# EAGLE design PIC18LF67K40-breakout (EAGLE 9.4.1)
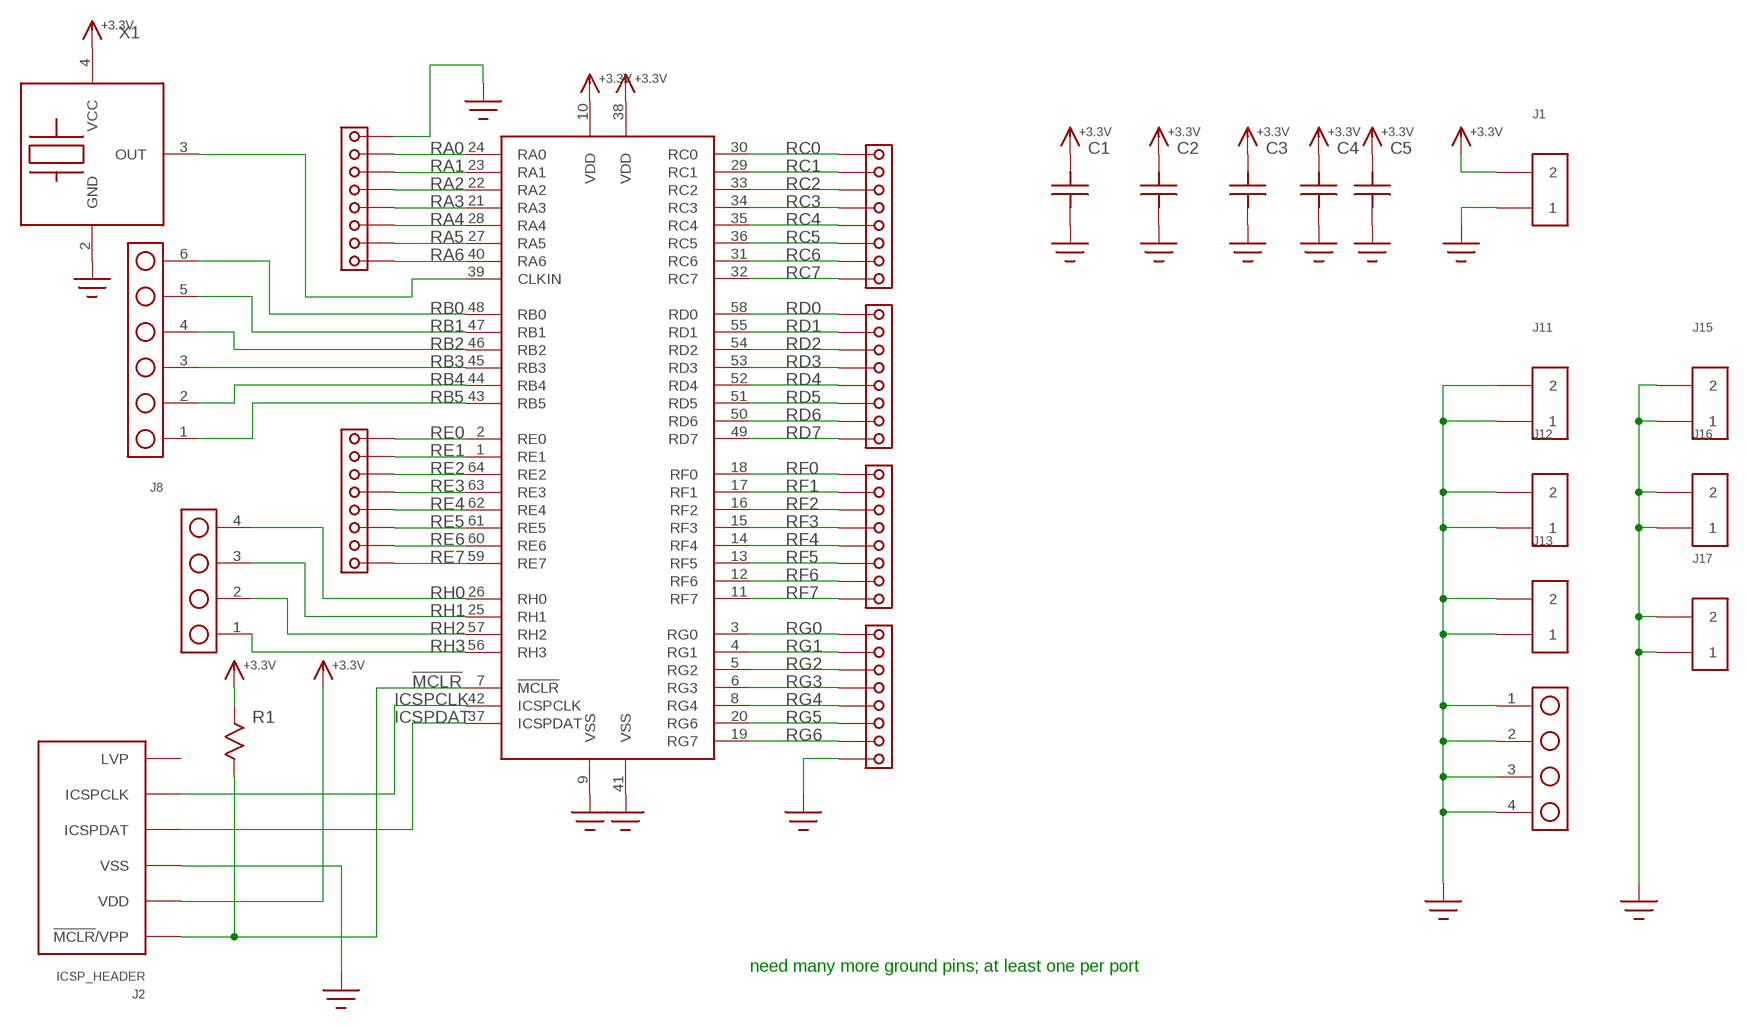
[diagram p0: schematic, sheet 1]

## Parts
C1  C1206  [1206]
C2  C1206  [1206]
C3  C0603  [C0603]
C4  C0603  [C0603]
C5  C0603  [C0603]
IC1  PIC18LF67K40  [TQFP-100-10X10]
J1  HEADER_2PIN  [HEADER_2PIN]
J2  ICSP_HEADER  [HEADER_6PIN]
J3  HEADER_8PIN_TIGHT  [HEADER_8_PIN]
J4  HEADER_8PIN_TIGHT  [HEADER_8_PIN]
J5  HEADER_8PIN_TIGHT  [HEADER_8_PIN]
J6  HEADER_8PIN_TIGHT  [HEADER_8_PIN]
J7  HEADER_8PIN_TIGHT  [HEADER_8_PIN]
J8  HEADER_6PIN  [HEADER_6PIN]
J9  HEADER_4PIN  [HEADER_4PIN]
J10  HEADER_8PIN_TIGHT  [HEADER_8_PIN]
J11  HEADER_2PIN  [HEADER_2PIN]
J12  HEADER_2PIN  [HEADER_2PIN]
J13  HEADER_2PIN  [HEADER_2PIN]
J14  HEADER_4PIN  [HEADER_4PIN]
J15  HEADER_2PIN  [HEADER_2PIN]
J16  HEADER_2PIN  [HEADER_2PIN]
J17  HEADER_2PIN  [HEADER_2PIN]
R1  R0603  [R0603]
X1  XTAL_OSC  [XTAL_3.2X5]

## Nets
!MCLR!: IC1.7(!MCLR!) J2.1(!MCLR!/VPP) R1.P$2
+3.3V: C1.P$2 C2.P$2 C3.P$2 C4.P$2 C5.P$2 IC1.10(VDD) IC1.38(VDD) J1.2 J2.2(VDD) R1.P$1 X1.4(VCC)
GND: C1.P$1 C2.P$1 C3.P$1 C4.P$1 C5.P$1 IC1.9(VSS) IC1.41(VSS) J1.1 J2.3(VSS) J6.8 J10.8 J11.1 J11.2 J12.1 J12.2 J13.1 J13.2 J14.1 J14.2 J14.3 J14.4 J15.1 J15.2 J16.1 J16.2 J17.1 J17.2 X1.2(GND)
ICSPCLK: IC1.42(ICSPCLK) J2.5(ICSPCLK)
ICSPDAT: IC1.37(ICSPDAT) J2.4(ICSPDAT)
N$11: IC1.39(CLKIN) X1.3(OUT)
RA0: IC1.24(RA0) J6.7
RA1: IC1.23(RA1) J6.6
RA2: IC1.22(RA2) J6.5
RA3: IC1.21(RA3) J6.4
RA4: IC1.28(RA4) J6.3
RA5: IC1.27(RA5) J6.2
RA6: IC1.40(RA6) J6.1
RB0: IC1.48(RB0) J8.6
RB1: IC1.47(RB1) J8.5
RB2: IC1.46(RB2) J8.4
RB3: IC1.45(RB3) J8.3
RB4: IC1.44(RB4) J8.2
RB5: IC1.43(RB5) J8.1
RC0: IC1.30(RC0) J3.1
RC1: IC1.29(RC1) J3.2
RC2: IC1.33(RC2) J3.3
RC3: IC1.34(RC3) J3.4
RC4: IC1.35(RC4) J3.5
RC5: IC1.36(RC5) J3.6
RC6: IC1.31(RC6) J3.7
RC7: IC1.32(RC7) J3.8
RD0: IC1.58(RD0) J4.1
RD1: IC1.55(RD1) J4.2
RD2: IC1.54(RD2) J4.3
RD3: IC1.53(RD3) J4.4
RD4: IC1.52(RD4) J4.5
RD5: IC1.51(RD5) J4.6
RD6: IC1.50(RD6) J4.7
RD7: IC1.49(RD7) J4.8
RE0: IC1.2(RE0) J7.8
RE1: IC1.1(RE1) J7.7
RE2: IC1.64(RE2) J7.6
RE3: IC1.63(RE3) J7.5
RE4: IC1.62(RE4) J7.4
RE5: IC1.61(RE5) J7.3
RE6: IC1.60(RE6) J7.2
RE7: IC1.59(RE7) J7.1
RF0: IC1.18(RF0) J5.1
RF1: IC1.17(RF1) J5.2
RF2: IC1.16(RF2) J5.3
RF3: IC1.15(RF3) J5.4
RF4: IC1.14(RF4) J5.5
RF5: IC1.13(RF5) J5.6
RF6: IC1.12(RF6) J5.7
RF7: IC1.11(RF7) J5.8
RG0: IC1.3(RG0) J10.1
RG1: IC1.4(RG1) J10.2
RG2: IC1.5(RG2) J10.3
RG3: IC1.6(RG3) J10.4
RG4: IC1.8(RG4) J10.5
RG5: IC1.20(RG6) J10.6
RG6: IC1.19(RG7) J10.7
RH0: IC1.26(RH0) J9.4
RH1: IC1.25(RH1) J9.3
RH2: IC1.57(RH2) J9.2
RH3: IC1.56(RH3) J9.1
Unconnected: J2.6(LVP)

## Notes on the sheet
- need many more ground pins; at least one per port

## Library data of the parts
C1-C5 = yapo:C
IC1 = yapo:PIC18LF67K40
J1 J11-J13 J15-J17 = yapo:HEADER_2PIN
J2 = yapo:ICSP_HEADER
J3-J7 J10 = yapo:HEADER_8PIN_TIGHT
J8 = yapo:HEADER_6PIN
J9 J14 = yapo:HEADER_4PIN
R1 = yapo:R
X1 = yapo:XTAL_OSC

## Board
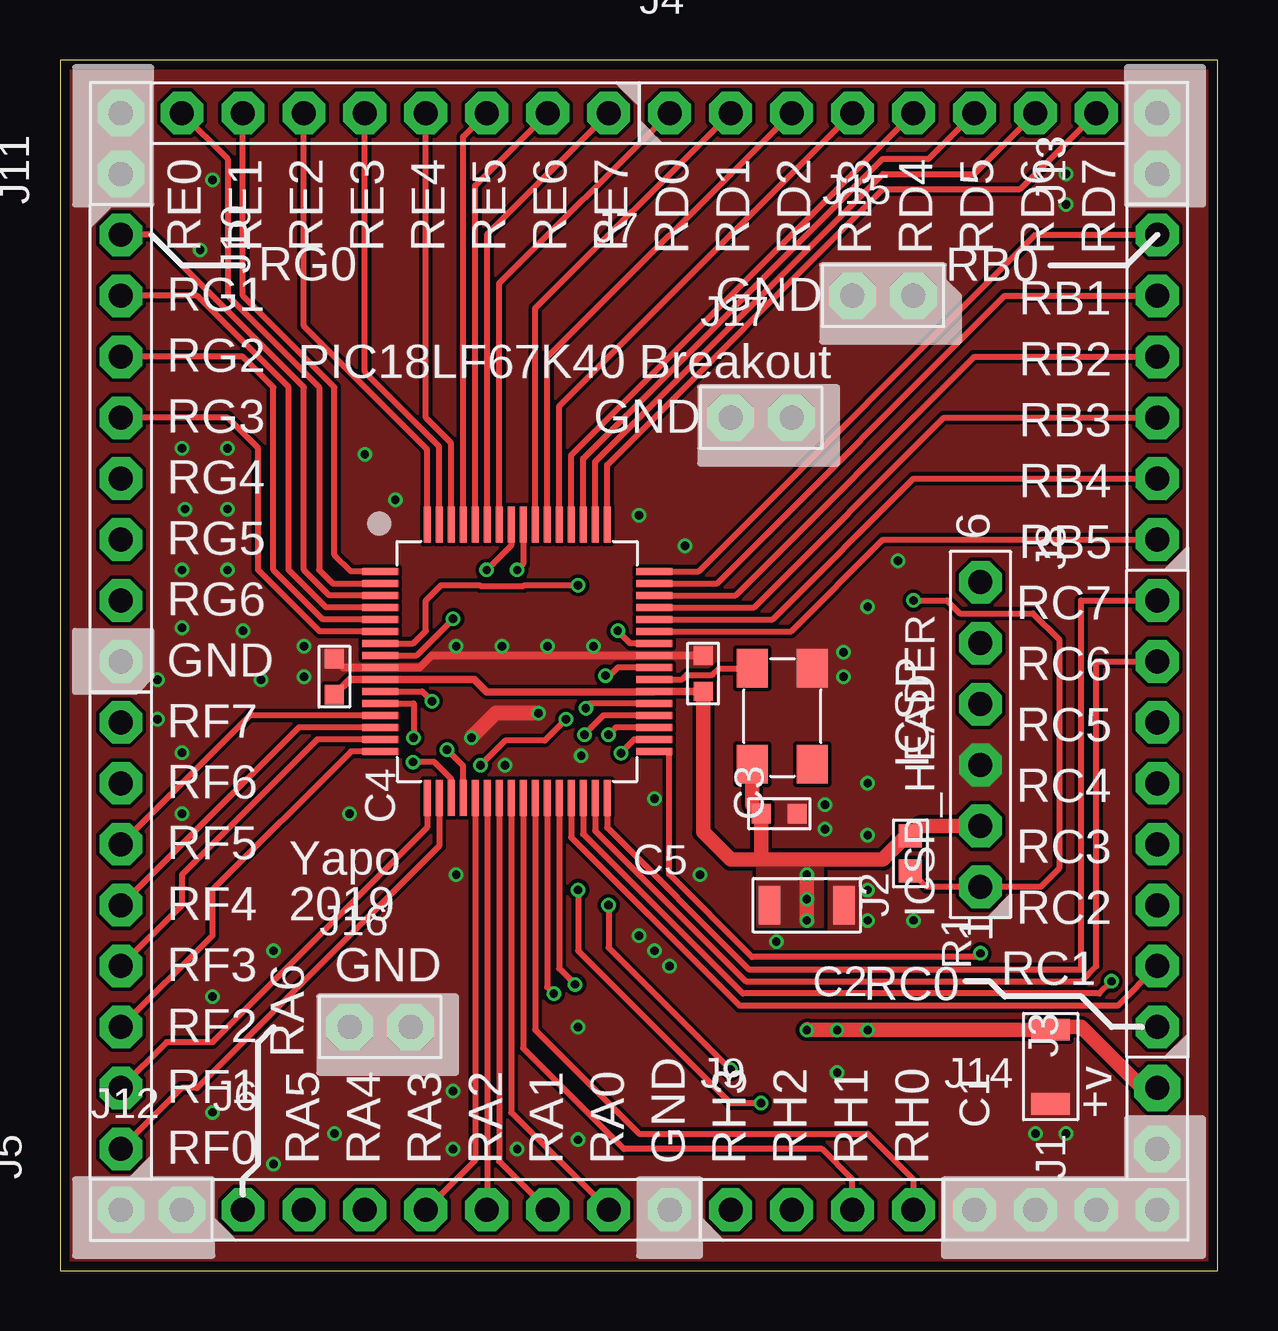
[diagram p1: board, top side]
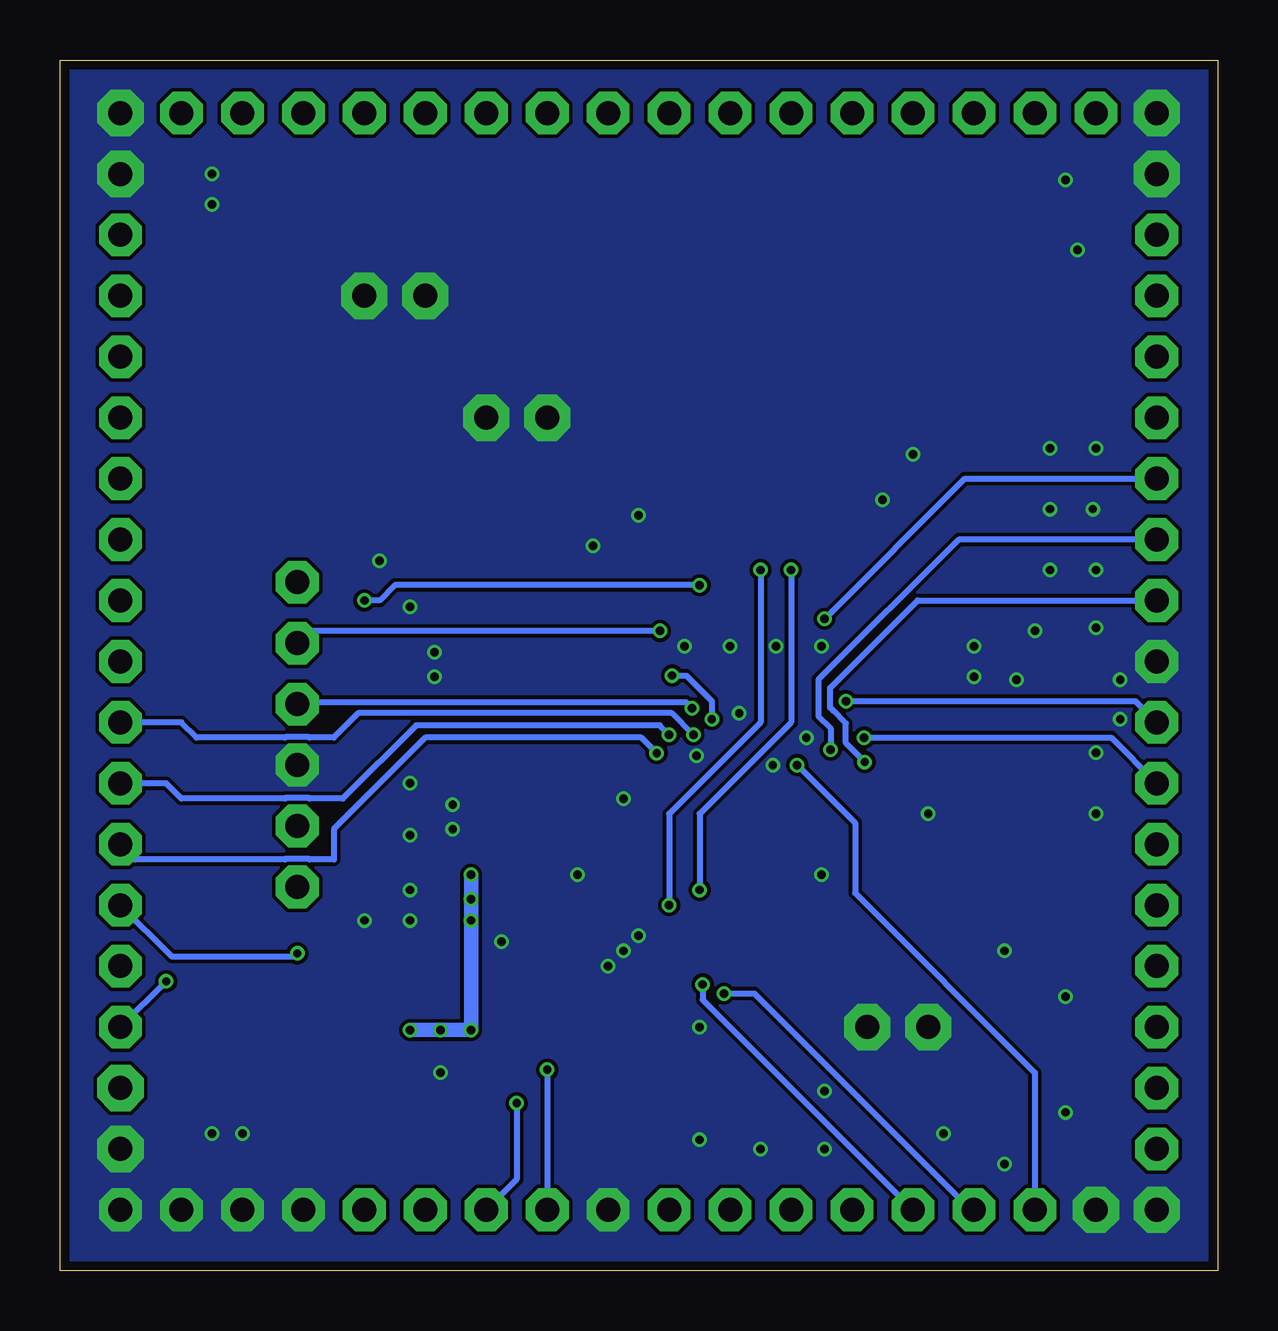
[diagram p2: board, bottom side, seen from below]

Size 48.24 x 50.47 mm. Coordinates in mm from the lower left corner, seen from the top.
Outline: 0,0 48.24,0 48.24,50.47 0,50.47 0,0
Copper layers (1*16): Top 0.035559375mm / dielectric 1.6mm / Bottom 0.035559375mm
Design rules "oshpark-2layer *": minimum track width 6mil, minimum drill 10mil, track to track 6mil, track to pad 6mil, pad to pad 6mil, via to via 6mil, smd to smd 6mil, copper to edge 15mil, drill to drill 6mil, minimum pad ring 5mil, minimum via ring 5mil, stop-mask expansion 2.5mil, vias tented up to drill 20mil, thermal gap 10mil

### Footprints (pad centres in the part's own frame; a part is rotated, then mirrored left to right if it is on the bottom)
1206 = smd 0.9 x 1.6: P$1 -1.55,0; P$2 1.55,0
C0603 = smd 0.8 x 0.8: P$1 -0.75,0; P$2 0.75,0
TQFP-100-10X10 = smd 1.5 x 0.3: 1 -5.7,3.75; 2 -5.7,3.25; 3 -5.7,2.75; 4 -5.7,2.25; 5 -5.7,1.75; 6 -5.7,1.25; 7 -5.7,0.75; 8 -5.7,0.25; 9 -5.7,-0.25; 10 -5.7,-0.75; 11 -5.7,-1.25; 12 -5.7,-1.75; 13 -5.7,-2.25; 14 -5.7,-2.75; 15 -5.7,-3.25; 16 -5.7,-3.75; 33 5.7,-3.75; 34 5.7,-3.25; 35 5.7,-2.75; 36 5.7,-2.25; 37 5.7,-1.75; 38 5.7,-1.25; 39 5.7,-0.75; 40 5.7,-0.25; 41 5.7,0.25; 42 5.7,0.75; 43 5.7,1.25; 44 5.7,1.75; 45 5.7,2.25; 46 5.7,2.75; 47 5.7,3.25; 48 5.7,3.75 | smd 0.3 x 1.5: 17 -3.75,-5.7; 18 -3.25,-5.7; 19 -2.75,-5.7; 20 -2.25,-5.7; 21 -1.75,-5.7; 22 -1.25,-5.7; 23 -0.75,-5.7; 24 -0.25,-5.7; 25 0.25,-5.7; 26 0.75,-5.7; 27 1.25,-5.7; 28 1.75,-5.7; 29 2.25,-5.7; 30 2.75,-5.7; 31 3.25,-5.7; 32 3.75,-5.7; 49 3.75,5.7; 50 3.25,5.7; 51 2.75,5.7; 52 2.25,5.7; 53 1.75,5.7; 54 1.25,5.7; 55 0.75,5.7; 56 0.25,5.7; 57 -0.25,5.7; 58 -0.75,5.7; 59 -1.25,5.7; 60 -1.75,5.7; 61 -2.25,5.7; 62 -2.75,5.7; 63 -3.25,5.7; 64 -3.75,5.7
HEADER_2PIN = drill 1 pad 1.93 octagon: 1 -1.27,0; 2 1.27,0
HEADER_6PIN = drill 1 pad 1.778 octagon: 1 -6.35,0; 2 -3.81,0; 3 -1.27,0; 4 1.27,0; 5 3.81,0; 6 6.35,0
HEADER_8_PIN = drill 1 pad 1.778 octagon: 1 -8.89,0; 2 -6.35,0; 3 -3.81,0; 4 -1.27,0; 5 1.27,0; 6 3.81,0; 7 6.35,0; 8 8.89,0
HEADER_4PIN = drill 1 pad 1.778 octagon: 1 -3.81,0; 2 -1.27,0; 3 1.27,0; 4 3.81,0
R0603 = smd 0.95 x 0.95: P$1 -0.725,0; P$2 0.725,0
XTAL_3.2X5 = smd 1.6 x 1.3: 1 -2,-1.25; 2 2,-1.25; 3 2,1.25; 4 -2,1.25

### Placement (x,y rotation side)
C1  41.27,8.51 90 top
C2  31.11,15.24 180 top
C3  26.8,24.89 270 top
C4  11.43,24.77 270 top
C5  29.97,19.05 180 top
IC1  19.05,25.4 0 top
J1  45.72,6.35 90 top
J2  38.35,22.35 90 top
J3  45.72,19.05 90 top
J4  34.29,48.26 0 top
J5  2.54,13.97 90 top
J6  16.51,2.54 0 top
J7  13.97,48.26 180 top
J8  45.72,36.83 90 top
J9  31.75,2.54 0 top
J10  2.54,34.29 270 top
J11  2.54,46.99 90 top
J12  3.81,2.54 0 top
J13  45.72,46.99 90 top
J14  41.91,2.54 0 top
J15  34.29,40.64 0 top
J16  13.34,10.16 0 top
J17  29.21,35.56 0 top
R1  35.43,17.4 270 top
X1  30.1,23.11 90 top

### Tracks (layer width: path | path; a pad name or v marks a point on that pad's centre or on a via)
!MCLR!  (via drill 0.35)
  Top 0.254: R1.P$2 36.1,16 J2.1 40.87,16 41.63,16.76 41.63,26.31 40.54,27.41 37.49,27.41 36.96,27.94 v35.56,27.94 | IC1.7 14.72,26.15 15.24,26.67 15.24,27.94 15.88,28.57 17.48,28.57 17.51,28.55 19.32,28.55 19.34,28.57 v21.59,28.57
  Bottom 0.254: v21.59,28.57 34.29,28.57 34.92,27.94 v35.56,27.94
+3.3V  (via drill 0.35)
  Top 0.254: IC1.38 24.77,24.15 24.75,24.13 | C3.P$2 | v32.38,10.03 32.36,10.06 31.14,10.06
  Top 0.305: C4.P$2 12.06,24.65 IC1.10 17.26,24.65 17.78,24.13 24.75,24.13 | 24.77,24.15 C3.P$2
  Top 0.61: J1.2 45.09,7.62 42.55,10.16 41.38,10.16 C1.P$2 41.25,10.03 v31.11,10.03 31.14,10.06 | J2.2 35.85,18.54 R1.P$1 35.27,18.12 34.29,17.14 29.21,17.14 | 29.21,17.14 29.21,19.04 C5.P$2 28.85,19.42 X1.4 | C3.P$2 26.8,18.29 27.94,17.14 29.21,17.14 | v31.11,14.61 v31.11,16.51
  Bottom 0.61: v33.66,10.03 v31.11,10.03 v31.11,16.51
  other vias: 31.11,15.49
  pour Top (no thermals): 31.75,14.35 29.08,14.35 29.08,17.14 31.75,17.14
GND  (via drill 0.35)
  Top 0.254: C3.P$1
  Top 0.305: C4.P$1 11.79,25.15 IC1.9 14.99,25.15 15.49,25.65 IC1.41 C3.P$1
  Top 0.61: v17.14,22.23 18.16,23.24 v19.94,23.24
  other vias: 24.77,19.68 6.35,45.47 10.16,24.77 10.16,26.04 32.64,24.77 32.64,25.78 31.88,19.43 22.23,26.04 31.88,18.41 6.99,29.21 6.99,31.75 6.99,34.29 5.08,21.59 4.06,22.99 12.06,19.05 16.51,16.51 6.35,11.43 16.38,7.49 16.38,5.08 19.05,5.08 21.59,5.46 21.59,10.16 24.77,13.34 33.66,15.88 33.66,14.61 40.64,5.71 41.91,5.71 26.67,16.51 35.56,14.61 32.38,8.26 33.66,20.32 33.66,27.69 34.92,29.59 26.04,30.23 24.13,31.5 13.97,32.13 12.7,34.04 41.91,45.72 41.91,44.45 5.84,42.55 5.08,34.29 5.21,31.75 5.08,29.21 5.08,26.8 7.62,26.67 4.06,24.64 8.38,24.64 5.08,19.05 8.89,13.34 8.89,4.45 6.35,6.6 11.43,5.71 16.51,26.04 18.41,26.04 20.32,26.04 29.84,13.72 18.54,21.08 21.72,21.46 33.66,18.16 24.13,13.97 25.4,12.7
  pour Top (rank 2, no thermals): 0,0 48.26,0 48.26,50.16 0,50.16
  pour Bottom (no thermals): 0,0 48.26,0 48.26,50.16 0,50.16
ICSPCLK  (via drill 0.35)
  Top 0.254: IC1.42 23.76,26.15 v23.24,26.67
  Bottom 0.254: v23.24,26.67 37.85,26.67 J2.5
ICSPDAT  (via drill 0.35)
  Top 0.254: IC1.37 22.11,23.65 v21.91,23.45
  Bottom 0.254: v21.91,23.45 22.16,23.7 38.27,23.7 J2.4
N$11
  Top 0.254: IC1.39 25.92,24.65 26.11,24.84 27.19,24.84 27.46,25.11 X1.3
RA0
  Top 0.254: IC1.24 18.8,6.6 J6.7
RA1
  Top 0.254: IC1.23 18.3,4.56 J6.6
RA2
  Top 0.254: IC1.22 17.8,2.56 J6.5
RA3
  Top 0.254: IC1.21 17.3,4.6 J6.4
RA4  (via drill 0.35)
  Top 0.254: IC1.28 20.8,12.6 v21.46,11.94
  Bottom 0.254: v21.46,11.94 21.46,11.3 J6.3
RA5  (via drill 0.35)
  Top 0.254: IC1.27 20.3,11.83 v20.57,11.56
  Bottom 0.254: v20.57,11.56 19.3,11.56 10.29,2.54 J6.2
RA6  (via drill 0.35)
  Top 0.254: IC1.40 23.25,25.15 22.86,24.77 22.78,24.77 v22.73,24.81 | v21.08,22.99 20.19,22.1 18.54,22.1 v17.53,21.08
  Bottom 0.254: v22.73,24.81 22.15,24.81 21.08,23.75 v21.08,22.99 | v17.53,21.08 15.11,18.67 15.11,15.75 7.62,8.26 J6.1
RB0
  Top 0.254: IC1.48 26.61,29.15 40.64,43.18 J8.6
RB1
  Top 0.254: IC1.47 27.38,28.65 39.37,40.64 J8.5
RB2
  Top 0.254: IC1.46 28.15,28.15 38.1,38.1 J8.4
RB3
  Top 0.254: IC1.45 28.92,27.65 36.83,35.56 J8.3
RB4
  Top 0.254: IC1.44 29.69,27.15 35.56,33.02 J8.2
RB5
  Top 0.254: IC1.43 30.46,26.65 34.29,30.48 J8.1
RC0  (via drill 0.35)
  Top 0.254: IC1.30 21.8,18.2 28.45,11.56 43.31,11.56 v43.81,12.06
  Bottom 0.254: v43.81,12.06 J3.1
RC1
  Top 0.254: IC1.29 21.3,18.07 28.32,11.05 44.07,11.05 J3.2
RC2  (via drill 0.35)
  Top 0.254: IC1.33 25.34,21.65 25.38,21.61 25.38,16.53 28.83,13.08 38.35,13.08 v38.35,13.23
  Bottom 0.254: v38.35,13.23 38.48,13.1 43.58,13.1 J3.3
RC3  (via drill 0.35)
  Top 0.254: IC1.34 23.93,22.15 23.38,21.6 v23.38,21.58
  Bottom 0.254: v23.38,21.58 24.02,22.23 33.02,22.23 36.83,18.41 36.83,17.14 37.84,17.14 37.87,17.17 38.84,17.17 38.86,17.14 45.09,17.14 J3.4
RC4  (via drill 0.35)
  Top 0.254: IC1.35 23.16,22.65 v22.86,22.35
  Bottom 0.254: v22.86,22.35 23.24,22.73 33.4,22.73 36.45,19.68 37.84,19.68 37.87,19.71 38.84,19.71 38.86,19.68 43.18,19.68 43.81,20.32 J3.5
RC5  (via drill 0.35)
  Top 0.254: IC1.36 22.64,23.15 21.85,22.36 v21.85,22.34
  Bottom 0.254: v21.85,22.34 22.75,23.24 35.81,23.24 36.83,22.23 37.84,22.23 37.87,22.25 38.84,22.25 38.86,22.23 42.55,22.23 43.18,22.86 J3.6
RC6
  Top 0.254: IC1.31 22.3,18.34 28.57,12.06 42.55,12.06 43.18,12.7 43.18,25.4 J3.7
RC7
  Top 0.254: IC1.32 22.8,18.48 28.7,12.57 42.55,12.57 42.55,27.94 J3.8
RD0
  Top 0.254: IC1.58 18.3,41.16 J4.1
RD1
  Top 0.254: IC1.55 19.8,40.12 J4.2
RD2
  Top 0.254: IC1.54 20.3,38.08 J4.3
RD3
  Top 0.254: IC1.53 20.8,36.04 J4.4
RD4
  Top 0.254: IC1.52 21.3,34 J4.5
RD5
  Top 0.254: IC1.51 21.8,33.87 34.29,46.35 36.2,46.35 J4.6
RD6
  Top 0.254: IC1.50 22.3,33.73 34.29,45.72 38.1,45.72 J4.7
RD7
  Top 0.254: IC1.49 22.8,33.59 34.29,45.09 40.01,45.09 J4.8
RE0
  Top 0.254: J7.8 6.99,46.35 6.99,40.64 10.79,36.83 10.79,29.21 11.36,28.65 IC1.2
RE1
  Top 0.254: IC1.1 12.12,29.15 11.43,29.84 11.43,36.83 7.62,40.64 J7.7
RE2
  Top 0.254: IC1.64 15.3,34.23 10.16,39.37 J7.6
RE3
  Top 0.254: IC1.63 15.8,34.37 12.7,37.47 J7.5
RE4
  Top 0.254: IC1.62 16.3,34.5 15.24,35.56 J7.4
RE5
  Top 0.254: IC1.61 16.8,47.28 J7.3
RE6
  Top 0.254: IC1.60 17.3,45.24 J7.2
RE7
  Top 0.254: IC1.59 17.8,43.2 J7.1
RF0
  Top 0.254: IC1.18 15.8,17.7 5.71,7.62 5.08,7.62 J5.1
RF1
  Top 0.254: IC1.17 15.3,18.48 6.35,9.53 4.45,9.53 J5.2
RF2
  Top 0.254: IC1.16 12.12,21.65 6.35,15.88 6.35,13.97 J5.3
RF3
  Top 0.254: IC1.15 10.72,22.15 5.08,16.51 5.08,15.24 J5.4
RF4
  Top 0.254: IC1.14 9.95,22.65 J5.5
RF5
  Top 0.254: IC1.13 7.91,23.15 J5.6
RF6  (via drill 0.35)
  Top 0.254: IC1.12 14.73,23.65 v14.73,22.23
  Bottom 0.254: v14.73,22.23 4.45,22.23 J5.7
RF7  (via drill 0.35)
  Top 0.254: IC1.11 15.09,24.15 v15.49,23.75
  Bottom 0.254: v15.49,23.75 3.43,23.75 J5.8
RG0
  Top 0.254: IC1.3 11.22,28.15 10.16,29.21 10.16,36.83 3.81,43.18 J10.1
RG1
  Top 0.254: IC1.4 11.09,27.65 9.53,29.21 9.53,36.83 5.71,40.64 J10.2
RG2
  Top 0.254: IC1.5 10.95,27.15 8.89,29.21 8.89,36.83 7.62,38.1 J10.3
RG3
  Top 0.254: IC1.6 10.81,26.65 8.26,29.21 8.26,34.29 6.99,35.56 J10.4
RG4  (via drill 0.35)
  Top 0.254: IC1.8 14.86,25.65 v16.38,27.18
  Bottom 0.254: v16.38,27.18 10.54,33.02 J10.5
RG5  (via drill 0.35)
  Top 0.254: IC1.20 16.8,21.05 v16.13,21.72
  Bottom 0.254: J10.6 10.79,30.48 16.64,24.64 16.64,23.11 16.13,22.61 v16.13,21.72
RG6  (via drill 0.35)
  Top 0.254: v14.71,21.21 15.6,21.21 16.3,20.51 IC1.19
  Bottom 0.254: v14.71,21.21 15.49,21.99 15.49,22.82 16.02,23.35 16.15,23.48 16.15,24.3 12.51,27.94 J10.7
RH0
  Top 0.254: IC1.26 19.8,10.04 24.13,5.71 33.66,5.71 35.56,3.81 J9.4
RH1
  Top 0.254: IC1.25 19.3,9.28 23.5,5.08 31.75,5.08 33.02,3.81 J9.3
RH2  (via drill 0.35)
  Top 0.254: IC1.57 18.8,30.23 v17.78,29.21 | v21.59,15.88 21.59,13.34 27.94,6.99 v29.21,6.99
  Bottom 0.254: v17.78,29.21 17.78,22.86 21.59,19.05 v21.59,15.88 | v29.21,6.99 29.21,3.81 J9.2
RH3  (via drill 0.35)
  Top 0.254: IC1.56 19.3,29.46 v19.05,29.21 | v22.86,15.24 22.86,13.46 v27.94,8.38
  Bottom 0.254: v19.05,29.21 19.05,22.86 22.86,19.05 v22.86,15.24 | v27.94,8.38 J9.1

### Text on the board
tPlace: RE0 | RE1 | RE2 | RE3 | RE4 | RE5 | RE6 | RE7 | RD0 | RD1 | RD2 | RD3 | RD4 | RD5 | RD6 | RD7 | RB0 | RG0 | RB1 | RG1 | GND | RB2 | RG2 | PIC18LF67K40 Breakout | RB3 | RG3 | GND | RB4 | RG4 | RB5 | RG5 | 6 | RC7 | RG6 | RC6 | GND | RC5 | RF7 | ICSP | RC4 | RF6 | RC3 | RF5 | Yapo | RC2 | RF4 | 2019 | 1 | RC0 | RC1 | RF3 | GND | RF2 | RA6 | RF1 | +v | RF0 | RA5 | RA4 | RA3 | RA2 | RA1 | RA0 | GND | RH3 | RH2 | RH1 | RH0